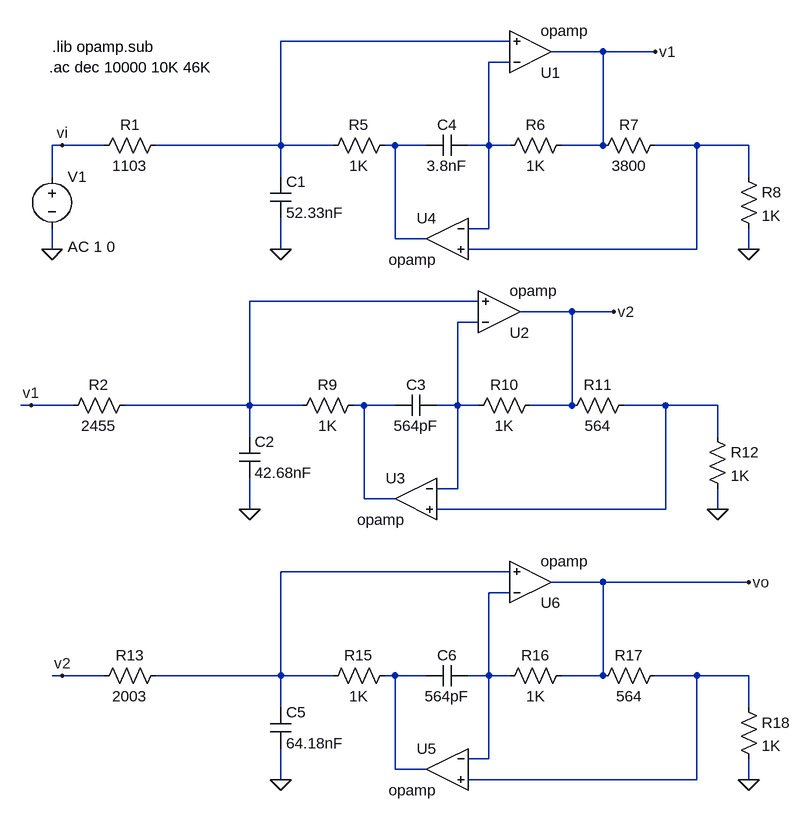
[diagram p0: schematic active.asc]
active.asc, the LTspice schematic file:
Version 4
SHEET 1 1196 1108
WIRE 672 -80 320 -80
WIRE 816 -64 736 -64
WIRE 896 -64 816 -64
WIRE 672 -48 640 -48
WIRE -16 80 -32 80
WIRE 48 80 -16 80
WIRE 320 80 320 -80
WIRE 320 80 128 80
WIRE 400 80 320 80
WIRE 496 80 480 80
WIRE 544 80 496 80
WIRE 640 80 640 -48
WIRE 640 80 608 80
WIRE 672 80 640 80
WIRE 816 80 816 -64
WIRE 816 80 752 80
WIRE 960 80 896 80
WIRE 1040 80 960 80
WIRE -32 128 -32 80
WIRE 320 128 320 80
WIRE 1040 128 1040 80
WIRE 640 208 640 80
WIRE 640 208 608 208
WIRE 496 224 496 80
WIRE 544 224 496 224
WIRE -32 240 -32 208
WIRE 320 240 320 192
WIRE 960 240 960 80
WIRE 960 240 608 240
WIRE 1040 240 1040 208
WIRE 624 320 272 320
WIRE 768 336 688 336
WIRE 832 336 768 336
WIRE 624 352 592 352
WIRE -64 480 -80 480
WIRE 0 480 -64 480
WIRE 272 480 272 320
WIRE 272 480 80 480
WIRE 352 480 272 480
WIRE 448 480 432 480
WIRE 496 480 448 480
WIRE 592 480 592 352
WIRE 592 480 560 480
WIRE 624 480 592 480
WIRE 768 480 768 336
WIRE 768 480 704 480
WIRE 912 480 848 480
WIRE 992 480 912 480
WIRE 272 528 272 480
WIRE 992 528 992 480
WIRE 592 608 592 480
WIRE 592 608 560 608
WIRE 448 624 448 480
WIRE 496 624 448 624
WIRE 272 640 272 592
WIRE 912 640 912 480
WIRE 912 640 560 640
WIRE 992 640 992 608
WIRE 672 736 320 736
WIRE 816 752 736 752
WIRE 1040 752 816 752
WIRE 672 768 640 768
WIRE -16 896 -32 896
WIRE 48 896 -16 896
WIRE 320 896 320 736
WIRE 320 896 128 896
WIRE 400 896 320 896
WIRE 496 896 480 896
WIRE 544 896 496 896
WIRE 640 896 640 768
WIRE 640 896 608 896
WIRE 672 896 640 896
WIRE 816 896 816 752
WIRE 816 896 752 896
WIRE 960 896 896 896
WIRE 1040 896 960 896
WIRE 320 944 320 896
WIRE 1040 944 1040 896
WIRE 640 1024 640 896
WIRE 640 1024 608 1024
WIRE 496 1040 496 896
WIRE 544 1040 496 1040
WIRE 320 1056 320 1008
WIRE 960 1056 960 896
WIRE 960 1056 608 1056
WIRE 1040 1056 1040 1024
FLAG -16 80 vi
FLAG 1040 240 0
FLAG -32 240 0
FLAG 896 -64 v1
FLAG -64 480 v1
FLAG 992 640 0
FLAG 832 336 v2
FLAG -16 896 v2
FLAG 1040 1056 0
FLAG 1040 752 vo
FLAG 320 240 0
FLAG 320 1056 0
FLAG 272 640 0
SYMBOL res 144 64 R90
WINDOW 0 0 56 VBottom 2
WINDOW 3 32 56 VTop 2
SYMATTR InstName R1
SYMATTR Value 1103
SYMBOL cap 304 128 R0
SYMATTR InstName C1
SYMATTR Value 52.33nF
SYMBOL res 496 64 R90
WINDOW 0 0 56 VBottom 2
WINDOW 3 32 56 VTop 2
SYMATTR InstName R5
SYMATTR Value 1K
SYMBOL cap 608 64 R90
WINDOW 0 0 32 VBottom 2
WINDOW 3 32 32 VTop 2
SYMATTR InstName C4
SYMATTR Value 3.8nF
SYMBOL res 768 64 R90
WINDOW 0 0 56 VBottom 2
WINDOW 3 32 56 VTop 2
SYMATTR InstName R6
SYMATTR Value 1K
SYMBOL res 912 64 R90
WINDOW 0 0 56 VBottom 2
WINDOW 3 32 56 VTop 2
SYMATTR InstName R7
SYMATTR Value 3800
SYMBOL OpAmps\\opamp 704 0 M180
SYMATTR InstName U1
SYMBOL OpAmps\\opamp 576 160 M0
SYMATTR InstName U4
SYMBOL res 1024 112 R0
SYMATTR InstName R8
SYMATTR Value 1K
SYMBOL voltage -32 112 R0
WINDOW 123 24 124 Left 2
WINDOW 39 0 0 Left 0
SYMATTR InstName V1
SYMATTR Value ""
SYMATTR Value2 AC 1 0
SYMBOL res 96 464 R90
WINDOW 0 0 56 VBottom 2
WINDOW 3 32 56 VTop 2
SYMATTR InstName R2
SYMATTR Value 2455
SYMBOL cap 256 528 R0
SYMATTR InstName C2
SYMATTR Value 42.68nF
SYMBOL res 448 464 R90
WINDOW 0 0 56 VBottom 2
WINDOW 3 32 56 VTop 2
SYMATTR InstName R9
SYMATTR Value 1K
SYMBOL cap 560 464 R90
WINDOW 0 0 32 VBottom 2
WINDOW 3 32 32 VTop 2
SYMATTR InstName C3
SYMATTR Value 564pF
SYMBOL res 720 464 R90
WINDOW 0 0 56 VBottom 2
WINDOW 3 32 56 VTop 2
SYMATTR InstName R10
SYMATTR Value 1K
SYMBOL res 864 464 R90
WINDOW 0 0 56 VBottom 2
WINDOW 3 32 56 VTop 2
SYMATTR InstName R11
SYMATTR Value 564
SYMBOL OpAmps\\opamp 656 400 M180
SYMATTR InstName U2
SYMBOL OpAmps\\opamp 528 560 M0
SYMATTR InstName U3
SYMBOL res 976 512 R0
SYMATTR InstName R12
SYMATTR Value 1K
SYMBOL res 144 880 R90
WINDOW 0 0 56 VBottom 2
WINDOW 3 32 56 VTop 2
SYMATTR InstName R13
SYMATTR Value 2003
SYMBOL cap 304 944 R0
SYMATTR InstName C5
SYMATTR Value 64.18nF
SYMBOL res 496 880 R90
WINDOW 0 0 56 VBottom 2
WINDOW 3 32 56 VTop 2
SYMATTR InstName R15
SYMATTR Value 1K
SYMBOL cap 608 880 R90
WINDOW 0 0 32 VBottom 2
WINDOW 3 32 32 VTop 2
SYMATTR InstName C6
SYMATTR Value 564pF
SYMBOL res 768 880 R90
WINDOW 0 0 56 VBottom 2
WINDOW 3 32 56 VTop 2
SYMATTR InstName R16
SYMATTR Value 1K
SYMBOL res 912 880 R90
WINDOW 0 0 56 VBottom 2
WINDOW 3 32 56 VTop 2
SYMATTR InstName R17
SYMATTR Value 564
SYMBOL OpAmps\\opamp 576 976 M0
SYMATTR InstName U5
SYMBOL res 1024 928 R0
SYMATTR InstName R18
SYMATTR Value 1K
SYMBOL OpAmps\\opamp 704 816 M180
SYMATTR InstName U6
TEXT -36 -40 Left 2 !.ac dec 10000 10K 46K
TEXT -32 -72 Left 2 !.lib opamp.sub

The netlist it stands for:
* active.asc
R1 N001 vi 1103
C1 N001 0 52.33nF
R5 N003 N001 1K
C4 N002 N003 3.8nF
R6 v1 N002 1K
R7 N004 v1 3800
XU1 N002 N001 v1 opamp Aol=100K GBW=10Meg  ; pins invin noninvin out
XU4 N002 N004 N003 opamp Aol=100K GBW=10Meg  ; pins invin noninvin out
R8 N004 0 1K
V1 vi 0 AC 1 0
R2 N005 v1 2455
C2 N005 0 42.68nF
R9 N007 N005 1K
C3 N006 N007 564pF
R10 v2 N006 1K
R11 N008 v2 564
XU2 N006 N005 v2 opamp Aol=100K GBW=10Meg  ; pins invin noninvin out
XU3 N006 N008 N007 opamp Aol=100K GBW=10Meg  ; pins invin noninvin out
R12 N008 0 1K
R13 N009 v2 2003
C5 N009 0 64.18nF
R15 N011 N009 1K
C6 N010 N011 564pF
R16 vo N010 1K
R17 N012 vo 564
XU5 N010 N012 N011 opamp Aol=100K GBW=10Meg  ; pins invin noninvin out
R18 N012 0 1K
XU6 N010 N009 vo opamp Aol=100K GBW=10Meg  ; pins invin noninvin out
.ac dec 10000 10K 46K
.lib opamp.sub
.backanno
.end